# Altium schematic sheet OSCILLAR_HFB_V1p0_MSYN.SchDoc
size A4; SheetNumber: 3; SheetTotal: 11
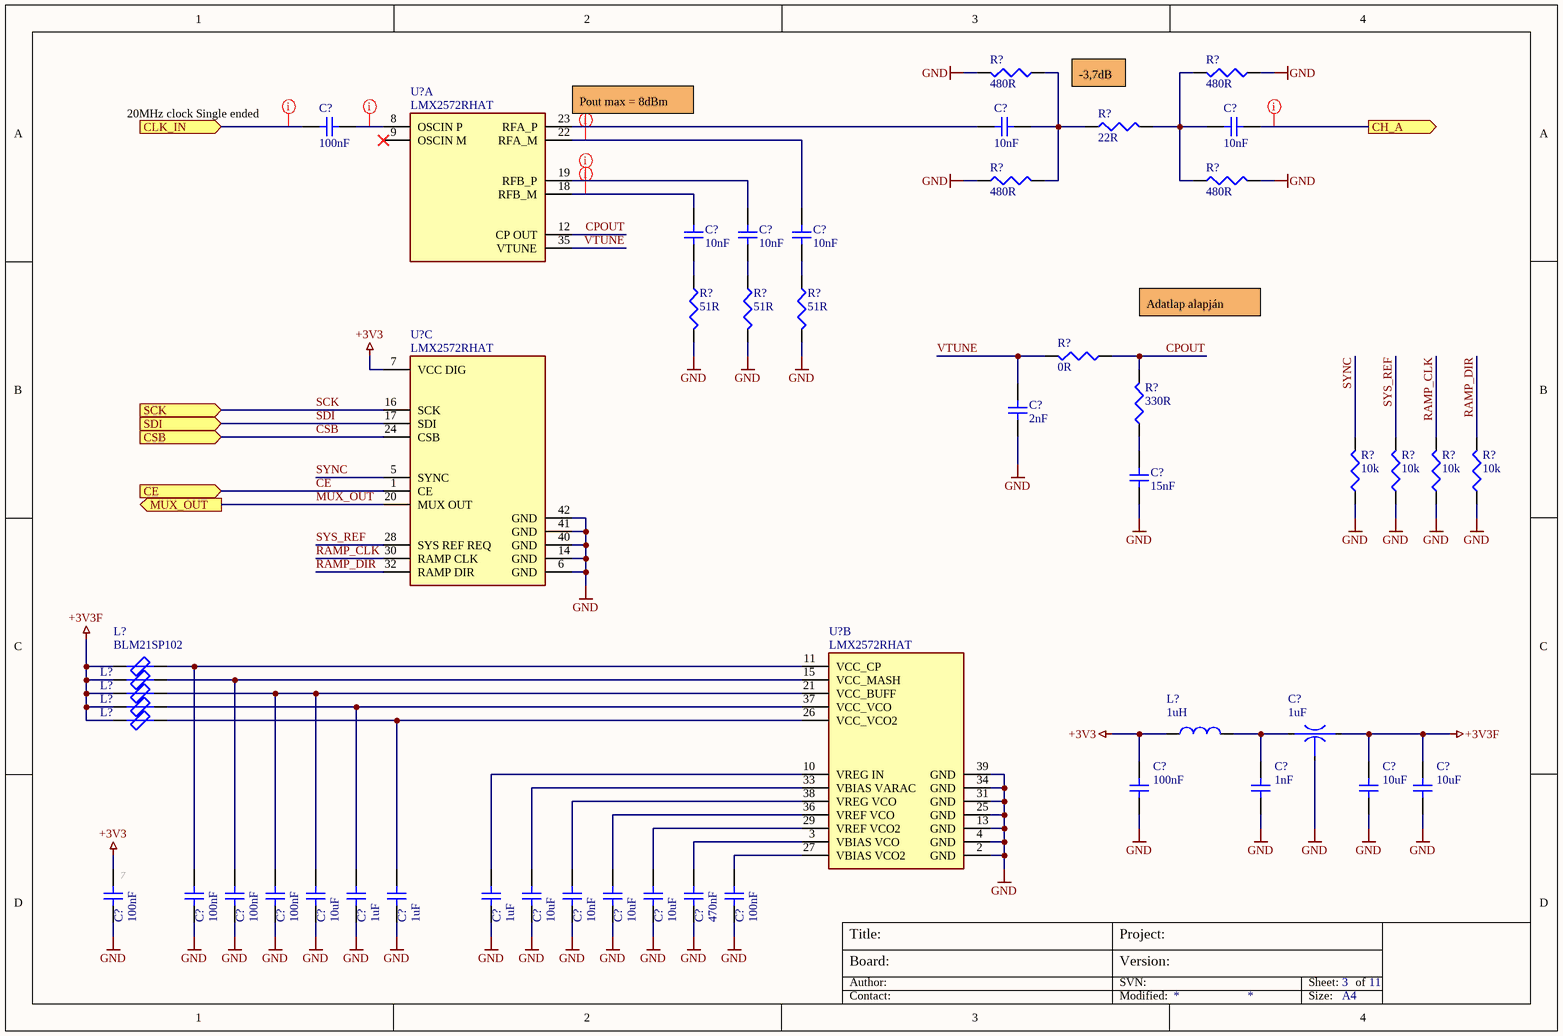
[diagram p0: OSCILLAR_HFB_V1p0_MSYN.SchDoc]

## Parts
(Parts that share a designator on the sheet are numbered #1, #2 ... from top to bottom, then left to right.)
C?#1  100nF  [CAP_0603]
C?#2  10nF  [CAP_0603]
C?#3  10nF  [CAP_0603]
C?#4  10nF  [CAP_0603]
C?#5  10nF  [CAP_0603]
C?#6  10nF  [CAP_0603]
C?#7  2nF  [CAP_0603]
C?#8  15nF  [CAP_0603]
C?#9  1uF  [CAP-0805-EMI]
C?#10  100nF  [CAP-0805]
C?#11  1nF  [CAP-0805]
C?#12  10uF  [CAP_0603]
C?#13  10uF  [CAP_0603]
C?#14  100nF  [CAP_0603]
C?#15  100nF  [CAP_0603]
C?#16  100nF  [CAP_0603]
C?#17  100nF  [CAP_0603]
C?#18  10uF  [CAP_0603]
C?#19  1uF  [CAP_0603]
C?#20  1uF  [CAP_0603]
C?#21  1uF  [CAP_0603]
C?#22  10uF  [CAP_0603]
C?#23  10nF  [CAP_0603]
C?#24  10uF  [CAP_0603]
C?#25  10uF  [CAP_0603]
C?#26  470nF  [CAP_0603]
C?#27  100nF  [CAP_0603]
L?#1  BLM21SP102  [IND-0805-EMI]
L?#2  1000R  [IND-0805-EMI]  (value not drawn)
L?#3  1000R  [IND-0805-EMI]  (value not drawn)
L?#4  1000R  [IND-0805-EMI]  (value not drawn)
L?#5  1000R  [IND-0805-EMI]  (value not drawn)
L?#6  1uH  [IND-0805]
R?#1  480R  [RES-0603]
R?#2  480R  [RES-0603]
R?#3  22R  [RES-0603]
R?#4  480R  [RES-0603]
R?#5  480R  [RES-0603]
R?#6  51R  [RES-0603]
R?#7  51R  [RES-0603]
R?#8  51R  [RES-0603]
R?#9  0R  [RES-0603]
R?#10  330R  [RES-0603]
R?#11  10k  [RES-0603]
R?#12  10k  [RES-0603]
R?#13  10k  [RES-0603]
R?#14  10k  [RES-0603]
U?#1  LMX2572RHAT  [VQFN40]  (part A of 3)
U?#2  LMX2572RHAT  [VQFN40]  (part C of 3)
U?#3  LMX2572RHAT  [VQFN40]  (part B of 3)

## Ports
CE (in, see OSCILLAR_HFB_V1p0_MAIN), CH_A (out, see OSCILLAR_HFB_V1p0_MAIN), CLK_IN (in, see OSCILLAR_HFB_V1p0_MAIN), CSB (in, see OSCILLAR_HFB_V1p0_MAIN), MUX_OUT (out, see OSCILLAR_HFB_V1p0_MAIN), SCK (in, see OSCILLAR_HFB_V1p0_MAIN), SDI (in, see OSCILLAR_HFB_V1p0_MAIN)

## Nets
+3V3: C?#10.1 C?#14.2 L?#6.1 U?#2.7(VCC_DIG)
+3V3F: C?#9.1 C?#12.1 C?#13.1 L?#1.1 L?#2.1 L?#3.1 L?#4.1 L?#5.1
GND: C?#7.2 C?#8.1 C?#9.2 C?#10.2 C?#11.2 C?#12.2 C?#13.2 C?#14.1 C?#15.1 C?#16.1 C?#17.1 C?#18.2 C?#19.1 C?#20.1 C?#21.2 C?#22.2 C?#23.2 C?#24.2 C?#25.2 C?#26.2 C?#27.2 R?#1.2 R?#2.2 R?#4.1 R?#5.1 R?#6.2 R?#7.2 R?#8.2 R?#11.1 R?#12.1 R?#13.1 R?#14.1 U?#2.6(GND) U?#2.14(GND) U?#2.40(GND) U?#2.41(GND) U?#2.42(GND) U?#3.2(GND) U?#3.4(GND) U?#3.13(GND) U?#3.25(GND) U?#3.31(GND) U?#3.34(GND) U?#3.39(GND)
CE: U?#2.1(CE) ; port CE
CH_A: C?#3.2 ; port CH_A
CLK_IN: C?#1.2 ; port CLK_IN
CPOUT: R?#9.1 R?#10.2 U?#1.12(CP_OUT)
CSB: U?#2.24(CSB) ; port CSB
MUX_OUT: U?#2.20(MUX_OUT) ; port MUX_OUT
RAMP_CLK: R?#13.2 U?#2.30(RAMP_CLK)
RAMP_DIR: R?#14.2 U?#2.32(RAMP_DIR)
SCK: U?#2.16(SCK) ; port SCK
SDI: U?#2.17(SDI) ; port SDI
SYNC: R?#11.2 U?#2.5(SYNC)
SYS_REF: R?#12.2 U?#2.28(SYS_REF_REQ)
VTUNE: C?#7.1 R?#9.2 U?#1.35(VTUNE)
NetC?#1_1: C?#1.1 U?#1.8(OSCIN_P)
NetC?#2_1: C?#2.1 R?#1.1 R?#3.2 R?#4.2
NetC?#2_2: C?#2.2 U?#1.23(RFA_P)
NetC?#3_1: C?#3.1 R?#2.1 R?#3.1 R?#5.2
NetC?#4_1: C?#4.1 U?#1.18(RFB_M)
NetC?#4_2: C?#4.2 R?#6.1
NetC?#5_1: C?#5.1 U?#1.19(RFB_P)
NetC?#5_2: C?#5.2 R?#7.1
NetC?#6_1: C?#6.1 U?#1.22(RFA_M)
NetC?#6_2: C?#6.2 R?#8.1
NetC?#8_2: C?#8.2 R?#10.1
NetC?#9_3: C?#9.3 C?#11.1 L?#6.2
NetC?#15_2: C?#15.2 L?#1.2 U?#3.11(VCC_CP)
NetC?#16_2: C?#16.2 L?#2.2 U?#3.15(VCC_MASH)
NetC?#17_2: C?#17.2 C?#18.1 L?#3.2 U?#3.21(VCC_BUFF)
NetC?#19_2: C?#19.2 L?#4.2 U?#3.37(VCC_VCO)
NetC?#20_2: C?#20.2 L?#5.2 U?#3.26(VCC_VCO2)
NetC?#21_1: C?#21.1 U?#3.10(VREG_IN)
NetC?#22_1: C?#22.1 U?#3.33(VBIAS_VARAC)
NetC?#23_1: C?#23.1 U?#3.38(VREG_VCO)
NetC?#24_1: C?#24.1 U?#3.36(VREF_VCO)
NetC?#25_1: C?#25.1 U?#3.29(VREF_VCO2)
NetC?#26_1: C?#26.1 U?#3.3(VBIAS_VCO)
NetC?#27_1: C?#27.1 U?#3.27(VBIAS_VCO2)

Not connected (* = marked no-connect by the designer): U?#1 9(OSCIN_M)*

## Layout directives
net class 50R: CH_A, CLK_IN, NetC?#1_1, NetC?#2_2, NetC?#4_1, NetC?#5_1, NetC?#6_1

## Notes on the sheet
- (near C?#1) 20MHz clock Single ended
- (near U?#1) Pout max = 8dBm
- (near R?#1) -3,7dB
- Adatlap alapján
- (near C?#14) 7
- Board:
- Author:
- Title:
- Project:
- SVN:
- Version:
- Sheet:
- of
- Contact:
- Modified:
- Size:
- A4

## Library data of the parts
C?#1-C?#8 C?#10-C?#27 = NP-CAPACITOR: MLCC capacitor; Type: CAP
C?#9 = EMI_CAPACITOR: EMI filter capacitor; Type: CAP
L?#1-L?#5 = BLM21SP102SN1D: Chip Ferrite Bead, 1000R @100MHz, 1.6A; Part number: 81-BLM21SP102SN1D; Type: IND; Supplier: Mouser; ComponentLink1Description: Datasheet; ComponentLink1URL: ENFA0005-1915781.pdf; ComponentLink2Description: Order; ComponentLink2URL: https://hu.mouser.com/ProductDetail/Murata-Electronics/BLM21SP102SN1D?qs=17u8i%2FzlE88oj6hmj%252BXptA%3D%3D
L?#6 = AC-INDUCTOR: Air core coil; Type: IND
R?#1-R?#14 = RESISTOR: Metal Film Resistor; Type: RES
U?#1-U?#3 = LMX2572RHAT: Phase Locked Loop, PLL 6.4-GHz, low power, wideband RF synthesizer with FSK modulation; Part number: 595-LMX2572RHAT; Supplier: Mouser; Type: IC; ComponentLink1Description: Datasheet; ComponentLink1URL: lmx2572lp.pdf; ComponentLink2Description: Order; ComponentLink2URL: https://hu.mouser.com/ProductDetail/Texas-Instruments/LMX2572RHAT?qs=BZBei1rCqCAcV8D5kfnwXg%3D%3D